# EAGLE schematic open-race-scale-load-amp (EAGLE 8.2.2)
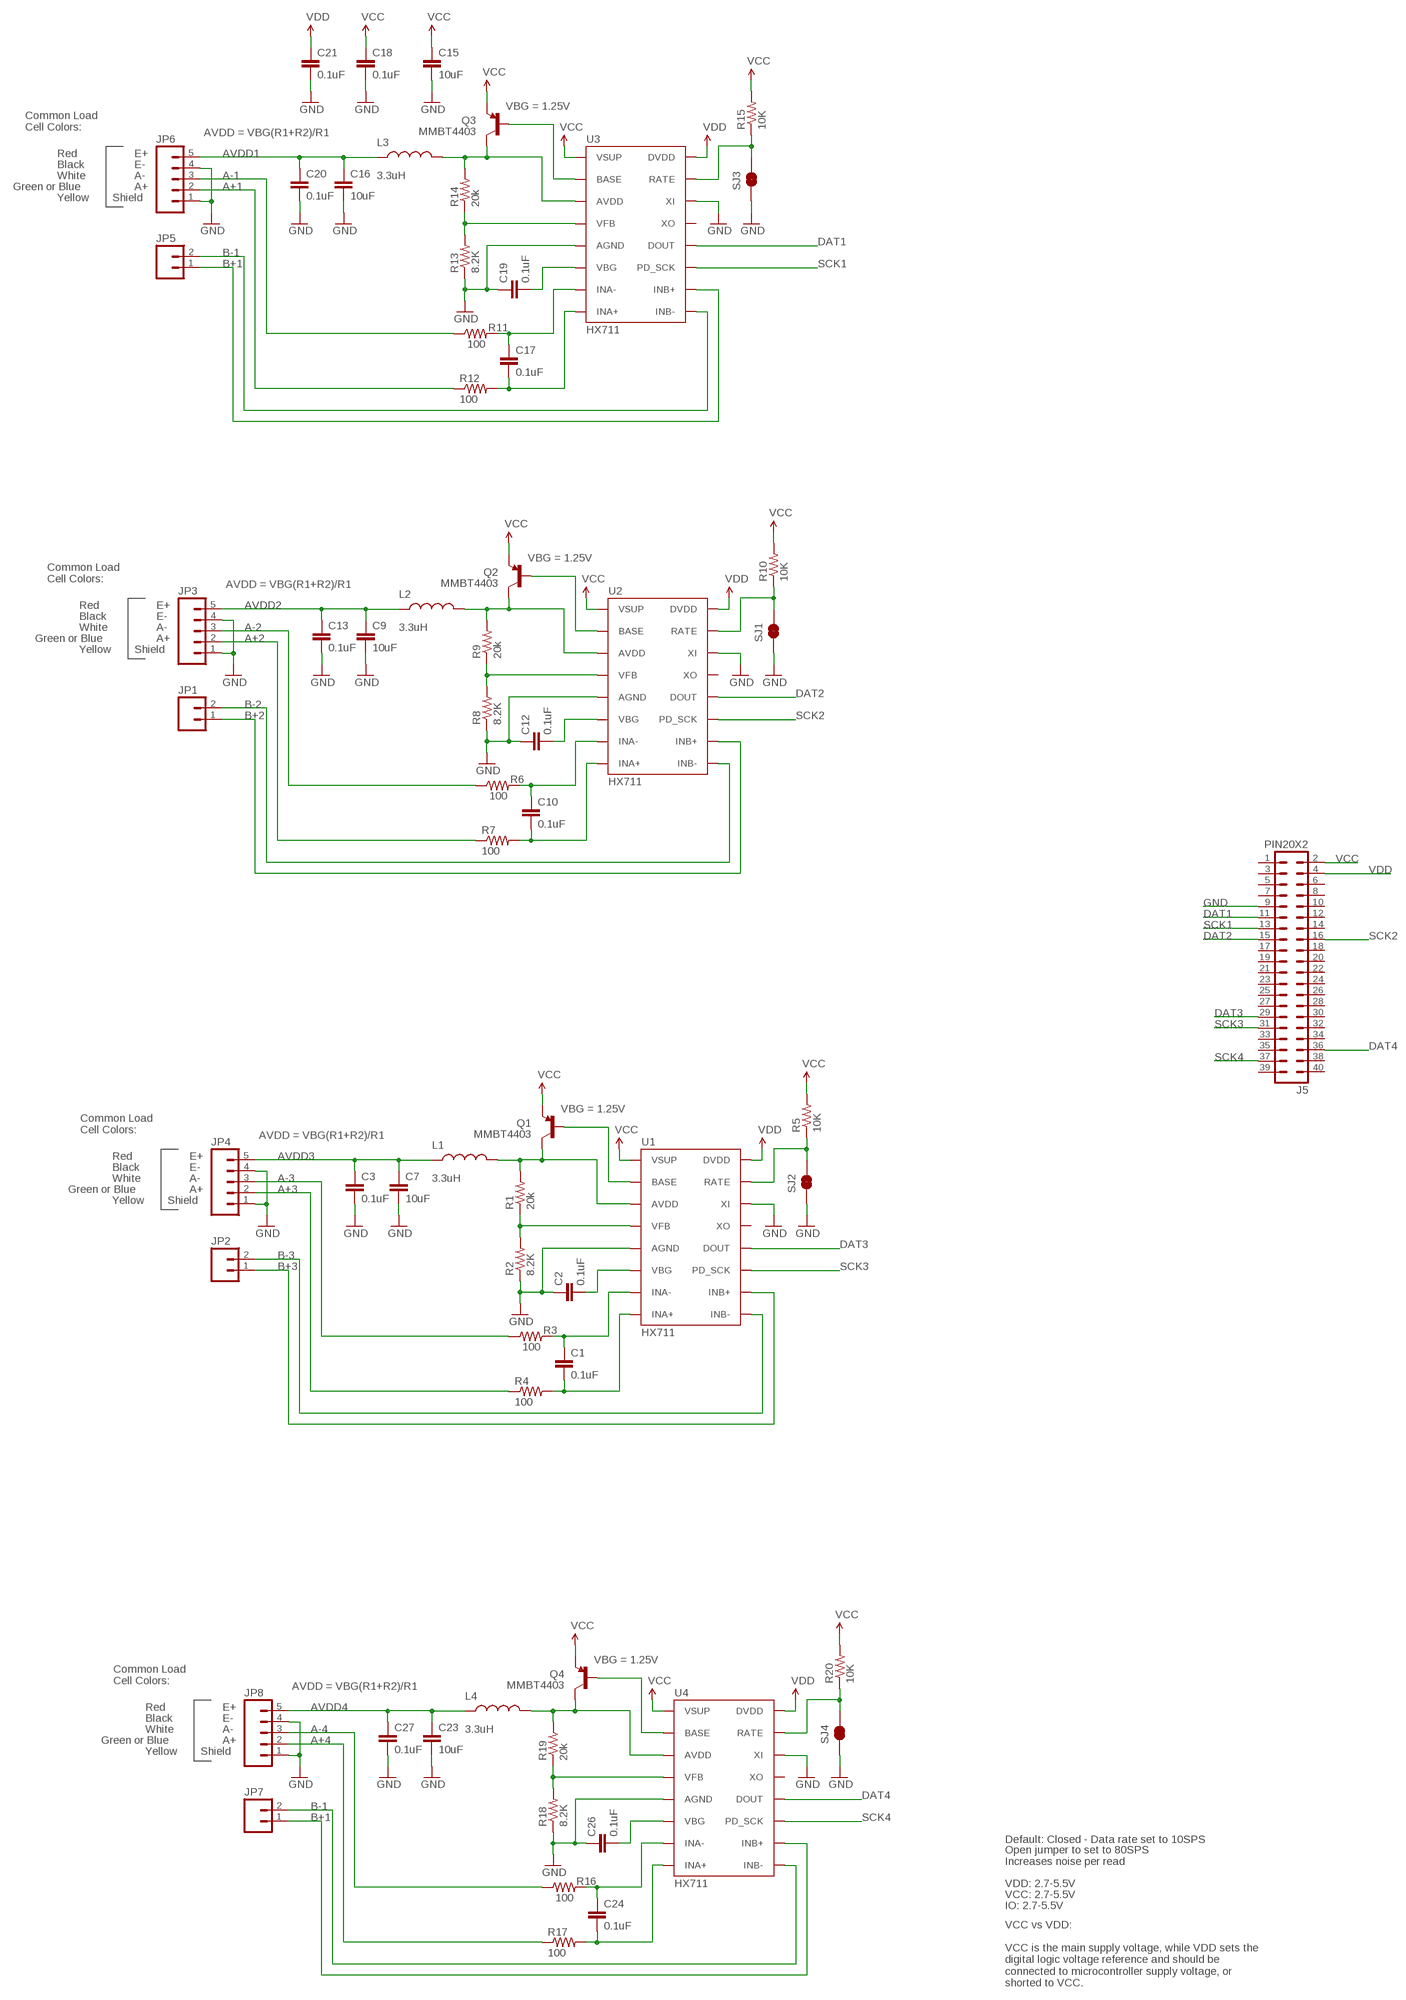
[diagram p0: schematic, sheet 1]

## Parts
C1  0.1uF  0.1UF-25V-5%(0603)  [0603-CAP]
C2  0.1uF  0.1UF-25V-5%(0603)  [0603-CAP]
C3  0.1uF  0.1UF-25V-5%(0603)  [0603-CAP]
C7  10uF  10UF50V20%(1210)  [1210]
C9  10uF  10UF50V20%(1210)  [1210]
C10  0.1uF  0.1UF-25V-5%(0603)  [0603-CAP]
C12  0.1uF  0.1UF-25V-5%(0603)  [0603-CAP]
C13  0.1uF  0.1UF-25V-5%(0603)  [0603-CAP]
C15  10uF  10UF50V20%(1210)  [1210]
C16  10uF  10UF50V20%(1210)  [1210]
C17  0.1uF  0.1UF-25V-5%(0603)  [0603-CAP]
C18  0.1uF  0.1UF-25V-5%(0603)  [0603-CAP]
C19  0.1uF  0.1UF-25V-5%(0603)  [0603-CAP]
C20  0.1uF  0.1UF-25V-5%(0603)  [0603-CAP]
C21  0.1uF  0.1UF-25V-5%(0603)  [0603-CAP]
C23  10uF  10UF50V20%(1210)  [1210]
C24  0.1uF  0.1UF-25V-5%(0603)  [0603-CAP]
C26  0.1uF  0.1UF-25V-5%(0603)  [0603-CAP]
C27  0.1uF  0.1UF-25V-5%(0603)  [0603-CAP]
J5  PIN20X2  [PIN_20X2]
JP1  M02PTH  [1X02]
JP2  M02PTH  [1X02]
JP3  M05PTH  [1X05]
JP4  M05PTH  [1X05]
JP5  M02PTH  [1X02]
JP6  M05PTH  [1X05]
JP7  M02PTH  [1X02]
JP8  M05PTH  [1X05]
L1  3.3uH  INDUCTOR0805-IND  [0805]
L2  3.3uH  INDUCTOR0805-IND  [0805]
L3  3.3uH  INDUCTOR0805-IND  [0805]
L4  3.3uH  INDUCTOR0805-IND  [0805]
Q1  MMBT4403  TRANSISTOR_PNPMMBT4403  [SOT23-3]
Q2  MMBT4403  TRANSISTOR_PNPMMBT4403  [SOT23-3]
Q3  MMBT4403  TRANSISTOR_PNPMMBT4403  [SOT23-3]
Q4  MMBT4403  TRANSISTOR_PNPMMBT4403  [SOT23-3]
R1  20k  20KOHM1/10W1%(0603)  [0603-RES]
R2  8.2K  8.2KOHM-1/10W-5%(0603)  [0603-RES]
R3  100  100OHM-1/10W-1%(0603)  [0603-RES]
R4  100  100OHM-1/10W-1%(0603)  [0603-RES]
R5  10K  10KOHM-1/10W-1%(0603)0603  [0603-RES]
R6  100  100OHM-1/10W-1%(0603)  [0603-RES]
R7  100  100OHM-1/10W-1%(0603)  [0603-RES]
R8  8.2K  8.2KOHM-1/10W-5%(0603)  [0603-RES]
R9  20k  20KOHM1/10W1%(0603)  [0603-RES]
R10  10K  10KOHM-1/10W-1%(0603)0603  [0603-RES]
R11  100  100OHM-1/10W-1%(0603)  [0603-RES]
R12  100  100OHM-1/10W-1%(0603)  [0603-RES]
R13  8.2K  8.2KOHM-1/10W-5%(0603)  [0603-RES]
R14  20k  20KOHM1/10W1%(0603)  [0603-RES]
R15  10K  10KOHM-1/10W-1%(0603)0603  [0603-RES]
R16  100  100OHM-1/10W-1%(0603)  [0603-RES]
R17  100  100OHM-1/10W-1%(0603)  [0603-RES]
R18  8.2K  8.2KOHM-1/10W-5%(0603)  [0603-RES]
R19  20k  20KOHM1/10W1%(0603)  [0603-RES]
R20  10K  10KOHM-1/10W-1%(0603)0603  [0603-RES]
SJ1  JUMPER-PAD-2-NC_BY_TRACE  [PAD-JUMPER-2-NC_BY_TRACE_YES_SILK]
SJ2  JUMPER-PAD-2-NC_BY_TRACE  [PAD-JUMPER-2-NC_BY_TRACE_YES_SILK]
SJ3  JUMPER-PAD-2-NC_BY_TRACE  [PAD-JUMPER-2-NC_BY_TRACE_YES_SILK]
SJ4  JUMPER-PAD-2-NC_BY_TRACE  [PAD-JUMPER-2-NC_BY_TRACE_YES_SILK]
U1  HX711  HX711HX711  [SO16]
U2  HX711  HX711HX711  [SO16]
U3  HX711  HX711HX711  [SO16]
U4  HX711  HX711HX711  [SO16]

## Nets
A+1: JP6.2 R12.1
A+2: JP3.2 R7.1
A+3: JP4.2 R4.1
A+4: JP8.2 R17.1
A-1: JP6.3 R11.1
A-2: JP3.3 R6.1
A-3: JP4.3 R3.1
A-4: JP8.3 R16.1
AVDD1: C16.1 C20.1 JP6.5 L3.1
AVDD2: C9.1 C13.1 JP3.5 L2.1
AVDD3: C3.1 C7.1 JP4.5 L1.1
AVDD4: C23.1 C27.1 JP8.5 L4.1
B+1: JP5.1 JP7.1 U3.10(INB+) U4.10(INB+)
B+2: JP1.1 U2.10(INB+)
B+3: JP2.1 U1.10(INB+)
B-1: JP5.2 JP7.2 U3.9(INB-) U4.9(INB-)
B-2: JP1.2 U2.9(INB-)
B-3: JP2.2 U1.9(INB-)
DAT1: J5.11 U3.12(DOUT)
DAT2: J5.15 U2.12(DOUT)
DAT3: J5.29 U1.12(DOUT)
DAT4: J5.36 U4.12(DOUT)
GND: C2.1 C3.2 C7.2 C9.2 C12.1 C13.2 C15.2 C16.2 C18.2 C19.1 C20.2 C21.2 C23.2 C26.1 C27.2 J5.9 JP3.1 JP3.4 JP4.1 JP4.4 JP6.1 JP6.4 JP8.1 JP8.4 R2.1 R8.1 R13.1 R18.1 SJ1.1 SJ2.1 SJ3.1 SJ4.1 U1.5(AGND) U1.14(XI) U2.5(AGND) U2.14(XI) U3.5(AGND) U3.14(XI) U4.5(AGND) U4.14(XI)
N$1: R5.1 SJ2.2 U1.15(RATE)
N$2: C1.1 R3.2 U1.7(INA-)
N$3: C1.2 R4.2 U1.8(INA+)
N$4: Q1.1(B) U1.2(BASE)
N$5: L1.2 Q1.3(C) R1.2 U1.3(AVDD)
N$6: R1.1 R2.2 U1.4(VFB)
N$7: C2.2 U1.6(VBG)
N$9: R8.2 R9.1 U2.4(VFB)
N$10: C12.2 U2.6(VBG)
N$20: C17.1 R11.2 U3.7(INA-)
N$21: C17.2 R12.2 U3.8(INA+)
N$22: Q4.1(B) U4.2(BASE)
N$23: R18.2 R19.1 U4.4(VFB)
N$24: C26.2 U4.6(VBG)
N$25: L4.2 Q4.3(C) R19.2 U4.3(AVDD)
N$26: R20.1 SJ4.2 U4.15(RATE)
N$27: C24.1 R16.2 U4.7(INA-)
N$28: C24.2 R17.2 U4.8(INA+)
N$82: Q2.1(B) U2.2(BASE)
N$112: L2.2 Q2.3(C) R9.2 U2.3(AVDD)
N$122: R10.1 SJ1.2 U2.15(RATE)
N$132: C10.1 R6.2 U2.7(INA-)
N$142: C10.2 R7.2 U2.8(INA+)
N$151: Q3.1(B) U3.2(BASE)
N$161: R13.2 R14.1 U3.4(VFB)
N$171: C19.2 U3.6(VBG)
N$182: L3.2 Q3.3(C) R14.2 U3.3(AVDD)
N$191: R15.1 SJ3.2 U3.15(RATE)
SCK1: J5.13 U3.11(PD_SCK)
SCK2: J5.16 U2.11(PD_SCK)
SCK3: J5.31 U1.11(PD_SCK)
SCK4: J5.37 U4.11(PD_SCK)
VCC: C15.1 C18.1 J5.2 Q1.2(E) Q2.2(E) Q3.2(E) Q4.2(E) R5.2 R10.2 R15.2 R20.2 U1.1(VSUP) U2.1(VSUP) U3.1(VSUP) U4.1(VSUP)
VDD: C21.1 J5.4 U1.16(DVDD) U2.16(DVDD) U3.16(DVDD) U4.16(DVDD)
Unconnected: J5.1 J5.3 J5.5 J5.6 J5.7 J5.8 J5.10 J5.12 J5.14 J5.17 J5.18 J5.19 J5.20 J5.21 J5.22 J5.23 J5.24 J5.25 J5.26 J5.27 J5.28 J5.30 J5.32 J5.33 J5.34 J5.35 J5.38 J5.39 J5.40 U1.13(XO) U2.13(XO) U3.13(XO) U4.13(XO)

## Notes on the sheet
- VBG = 1.25V
- Common Load
  Cell Colors:
- AVDD = VBG(R1+R2)/R1
- Red | E+
- Black | E-
- White | A-
- Green or Blue | A+
- Yellow | Shield
- VBG = 1.25V
- Common Load
  Cell Colors:
- AVDD = VBG(R1+R2)/R1
- Red | E+
- Black | E-
- White | A-
- Green or Blue | A+
- Yellow | Shield
- VBG = 1.25V
- Common Load
  Cell Colors:
- AVDD = VBG(R1+R2)/R1
- Red | E+
- Black | E-
- White | A-
- Green or Blue | A+
- Yellow | Shield
- VBG = 1.25V
- Common Load
  Cell Colors:
- AVDD = VBG(R1+R2)/R1
- Red | E+
- Black | E-
- White | A-
- Green or Blue | A+
- Yellow | Shield
- Default: Closed - Data rate set to 10SPS
- Open jumper to set to 80SPS
  Increases noise per read
- VDD: 2.7-5.5V
- VCC: 2.7-5.5V
- IO: 2.7-5.5V
- VCC vs VDD:
  
  VCC is the main supply voltage, while VDD sets the
  digital logic voltage reference and should be
  connected to microcontroller supply voltage, or
  shorted to VCC.

## Library data of the parts
C1-C3 C10 C12 C13 C17-C21 C24 C26 C27 = SparkFun-Capacitors:0.1UF-25V-5%(0603): CAP-08604; PROD_ID: CAP-08604
C7 C9 C15 C16 C23 = SparkFun-Capacitors:10UF50V20%(1210): CAP-09824; PROD_ID: CAP-09824
J5 = FLYFISH:PIN20X2
JP1 JP2 JP5 JP7 = SparkFun-Connectors:M02: Standard 2-pin 0.1" header. Use with - straight break away headers ( PRT-00116) - right angle break away headers (PRT-00553) - swiss pins (PRT-00743) - machine pins (PRT-00117) - female headers (PRT-00115) Molex polarized connector foot print use with: PRT-08233 with associated crimp pins and housings. 2.54_SCREWTERM for use with PRT-10571. 3.5mm Screw Terminal footprints for PRT-08084 5mm Screw Terminal footprints for use with PRT-08432
JP3 JP4 JP6 JP8 = SparkFun-Connectors:M05: Header 5 Standard 5-pin 0.1" header. Use with straight break away headers (SKU : PRT-00116), right angle break away headers (PRT-00553), swiss pins (PRT-00743), machine pins (PRT-00117), and female headers (PRT-00115). Molex polarized connector foot print use with SKU : PRT-08230 with associated crimp pins and housings.
L1-L4 = SparkFun-Passives:INDUCTOR: Inductors Basic Inductor/Choke - 0603 and 1206. Footprints are not proven and vary greatly between part numbers. INDUCTOR POWER 3.3UH 4.0A SMD 0.197" L x 0.197" W x 0.177" H (5.00mm x 5.00mm x 4.50mm); PROD_ID: NDUC-13076
Q1-Q4 = SparkFun-DiscreteSemi:TRANSISTOR_PNP: Generic PNP BJT Double check pinouts against datasheets- not all devices are the same! MMBT3906 - 40V 200mA SOT-23 (TRANS-08052) MMBT4403 - 40V 600mA SOT-23 (TRANS-09245); PROD_ID: TRANS-09245
R1 R9 R14 R19 = SparkFun-Resistors:20KOHM1/10W1%(0603): RES-09383; PROD_ID: RES-09383
R2 R8 R13 R18 = SparkFun-Resistors:8.2KOHM-1/10W-5%(0603): RES-10646; PROD_ID: RES-10646
R3 R4 R6 R7 R11 R12 R16 R17 = SparkFun-Resistors:100OHM-1/10W-1%(0603): RES-07863; PROD_ID: RES-07863
R5 R10 R15 R20 = SparkFun-Resistors:10KOHM-1/10W-1%(0603): RES-00824; PROD_ID: RES-00824
SJ1-SJ4 = SparkFun-Passives:JUMPER-PAD-2-NC_BY_TRACE
U1-U4 = Testing:HX711; PROD_ID: IC-12445